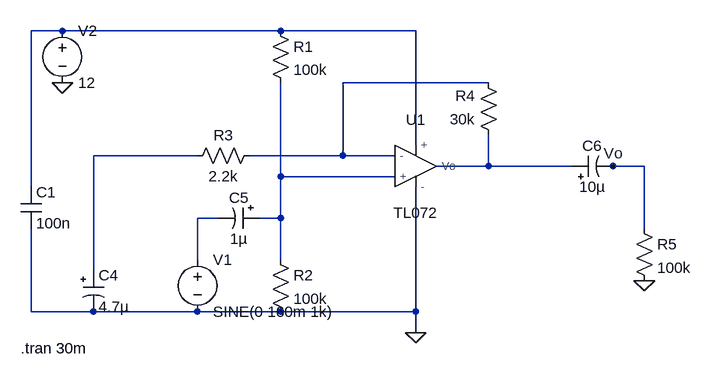
[diagram p0: schematic pre amp.asc]
pre amp.asc, the LTspice schematic file:
Version 4.1
SHEET 1 880 680
WIRE -352 32 -400 32
WIRE -16 32 -352 32
WIRE 192 32 -16 32
WIRE 304 112 80 112
WIRE 192 208 192 32
WIRE -144 224 -304 224
WIRE 80 224 80 112
WIRE 80 224 -64 224
WIRE 160 224 80 224
WIRE 304 240 304 192
WIRE 304 240 224 240
WIRE 432 240 304 240
WIRE 496 240 480 240
WIRE 544 240 496 240
WIRE -16 256 -16 112
WIRE 160 256 -16 256
WIRE -400 272 -400 32
WIRE -112 320 -144 320
WIRE -16 320 -16 256
WIRE -16 320 -48 320
WIRE 544 336 544 240
WIRE -144 384 -144 320
WIRE -16 384 -16 320
WIRE -304 400 -304 224
WIRE -400 464 -400 336
WIRE -304 464 -400 464
WIRE -144 464 -304 464
WIRE -16 464 -144 464
WIRE 192 464 192 272
WIRE 192 464 -16 464
WIRE 192 496 192 464
FLAG 192 496 0
FLAG -352 112 0
FLAG 496 240 Vo
FLAG 544 416 0
SYMBOL TL072 192 240 R0
SYMATTR InstName U1
SYMBOL res -32 16 R0
SYMATTR InstName R1
SYMATTR Value 100k
SYMBOL res -32 368 R0
SYMATTR InstName R2
SYMATTR Value 100k
SYMBOL res -48 208 R90
WINDOW 0 0 56 VBottom 2
WINDOW 3 32 56 VTop 2
SYMATTR InstName R3
SYMATTR Value 2.2k
SYMBOL res 320 208 R180
WINDOW 0 36 76 Left 2
WINDOW 3 36 40 Left 2
SYMATTR InstName R4
SYMATTR Value 30k
SYMBOL cap -416 272 R0
SYMATTR InstName C1
SYMATTR Value 100n
SYMBOL polcap -320 400 R0
SYMATTR InstName C4
SYMATTR Value 4.7µ
SYMBOL polcap -48 304 R90
WINDOW 0 0 32 VBottom 2
WINDOW 3 32 32 VTop 2
SYMATTR InstName C5
SYMATTR Value 1µ
SYMBOL polcap 432 256 R270
WINDOW 0 32 32 VTop 2
WINDOW 3 0 32 VBottom 2
SYMATTR InstName C6
SYMATTR Value 10µ
SYMBOL voltage -144 368 R0
WINDOW 123 0 0 Left 0
WINDOW 39 0 0 Left 0
SYMATTR InstName V1
SYMATTR Value SINE(0 160m 1k)
SYMBOL voltage -352 16 R0
WINDOW 123 0 0 Left 0
WINDOW 39 0 0 Left 0
SYMATTR InstName V2
SYMATTR Value 12
SYMBOL res 528 320 R0
SYMATTR InstName R5
SYMATTR Value 100k
TEXT -416 520 Left 2 !.tran 30m

The netlist it stands for:
* pre amp.asc
X§U1 N005 N002 N001 0 N004 TL072  ; pins + - + - Vo
R1 N001 N005 100k
R2 N005 0 100k
R3 N002 N003 2.2k
R4 N004 N002 30k
C1 N001 0 100n
C4 N003 0 4.7µ
C5 N005 N006 1µ
C6 N004 Vo 10µ
V1 N006 0 SINE(0 160m 1k)
V2 N001 0 12
R5 Vo 0 100k
.tran 30m
.lib C:\Users\ASUS TUF X506H\AppData\Local\Microsoft\Windows\INetCache\IE\LMH602MS\TL072[2].txt
.backanno
.end